# Altium schematic sheet FMC_HPC2.SchDoc: AMC FMC Carrier v4
size A2; CompanyName: WUT; Organization: WUT ISE; Address1: Warsaw Univeristy of Technology; Address2: Nowowiejska 15/19 00-665 Warsaw; Address3: t.przywozki@gmail.com; Revision: 1; SheetNumber: 8; SheetTotal: 29; Project: AMC FMC Carrier v4; ModifiedBy: -; CheckedDate: -; Title2: FPGA banks HPC2 / RTM; DivGrp: ISE; Designer: T. Przywozki; ModifiedDate: -; ProjectName: ADC/DAC MEZZANINE
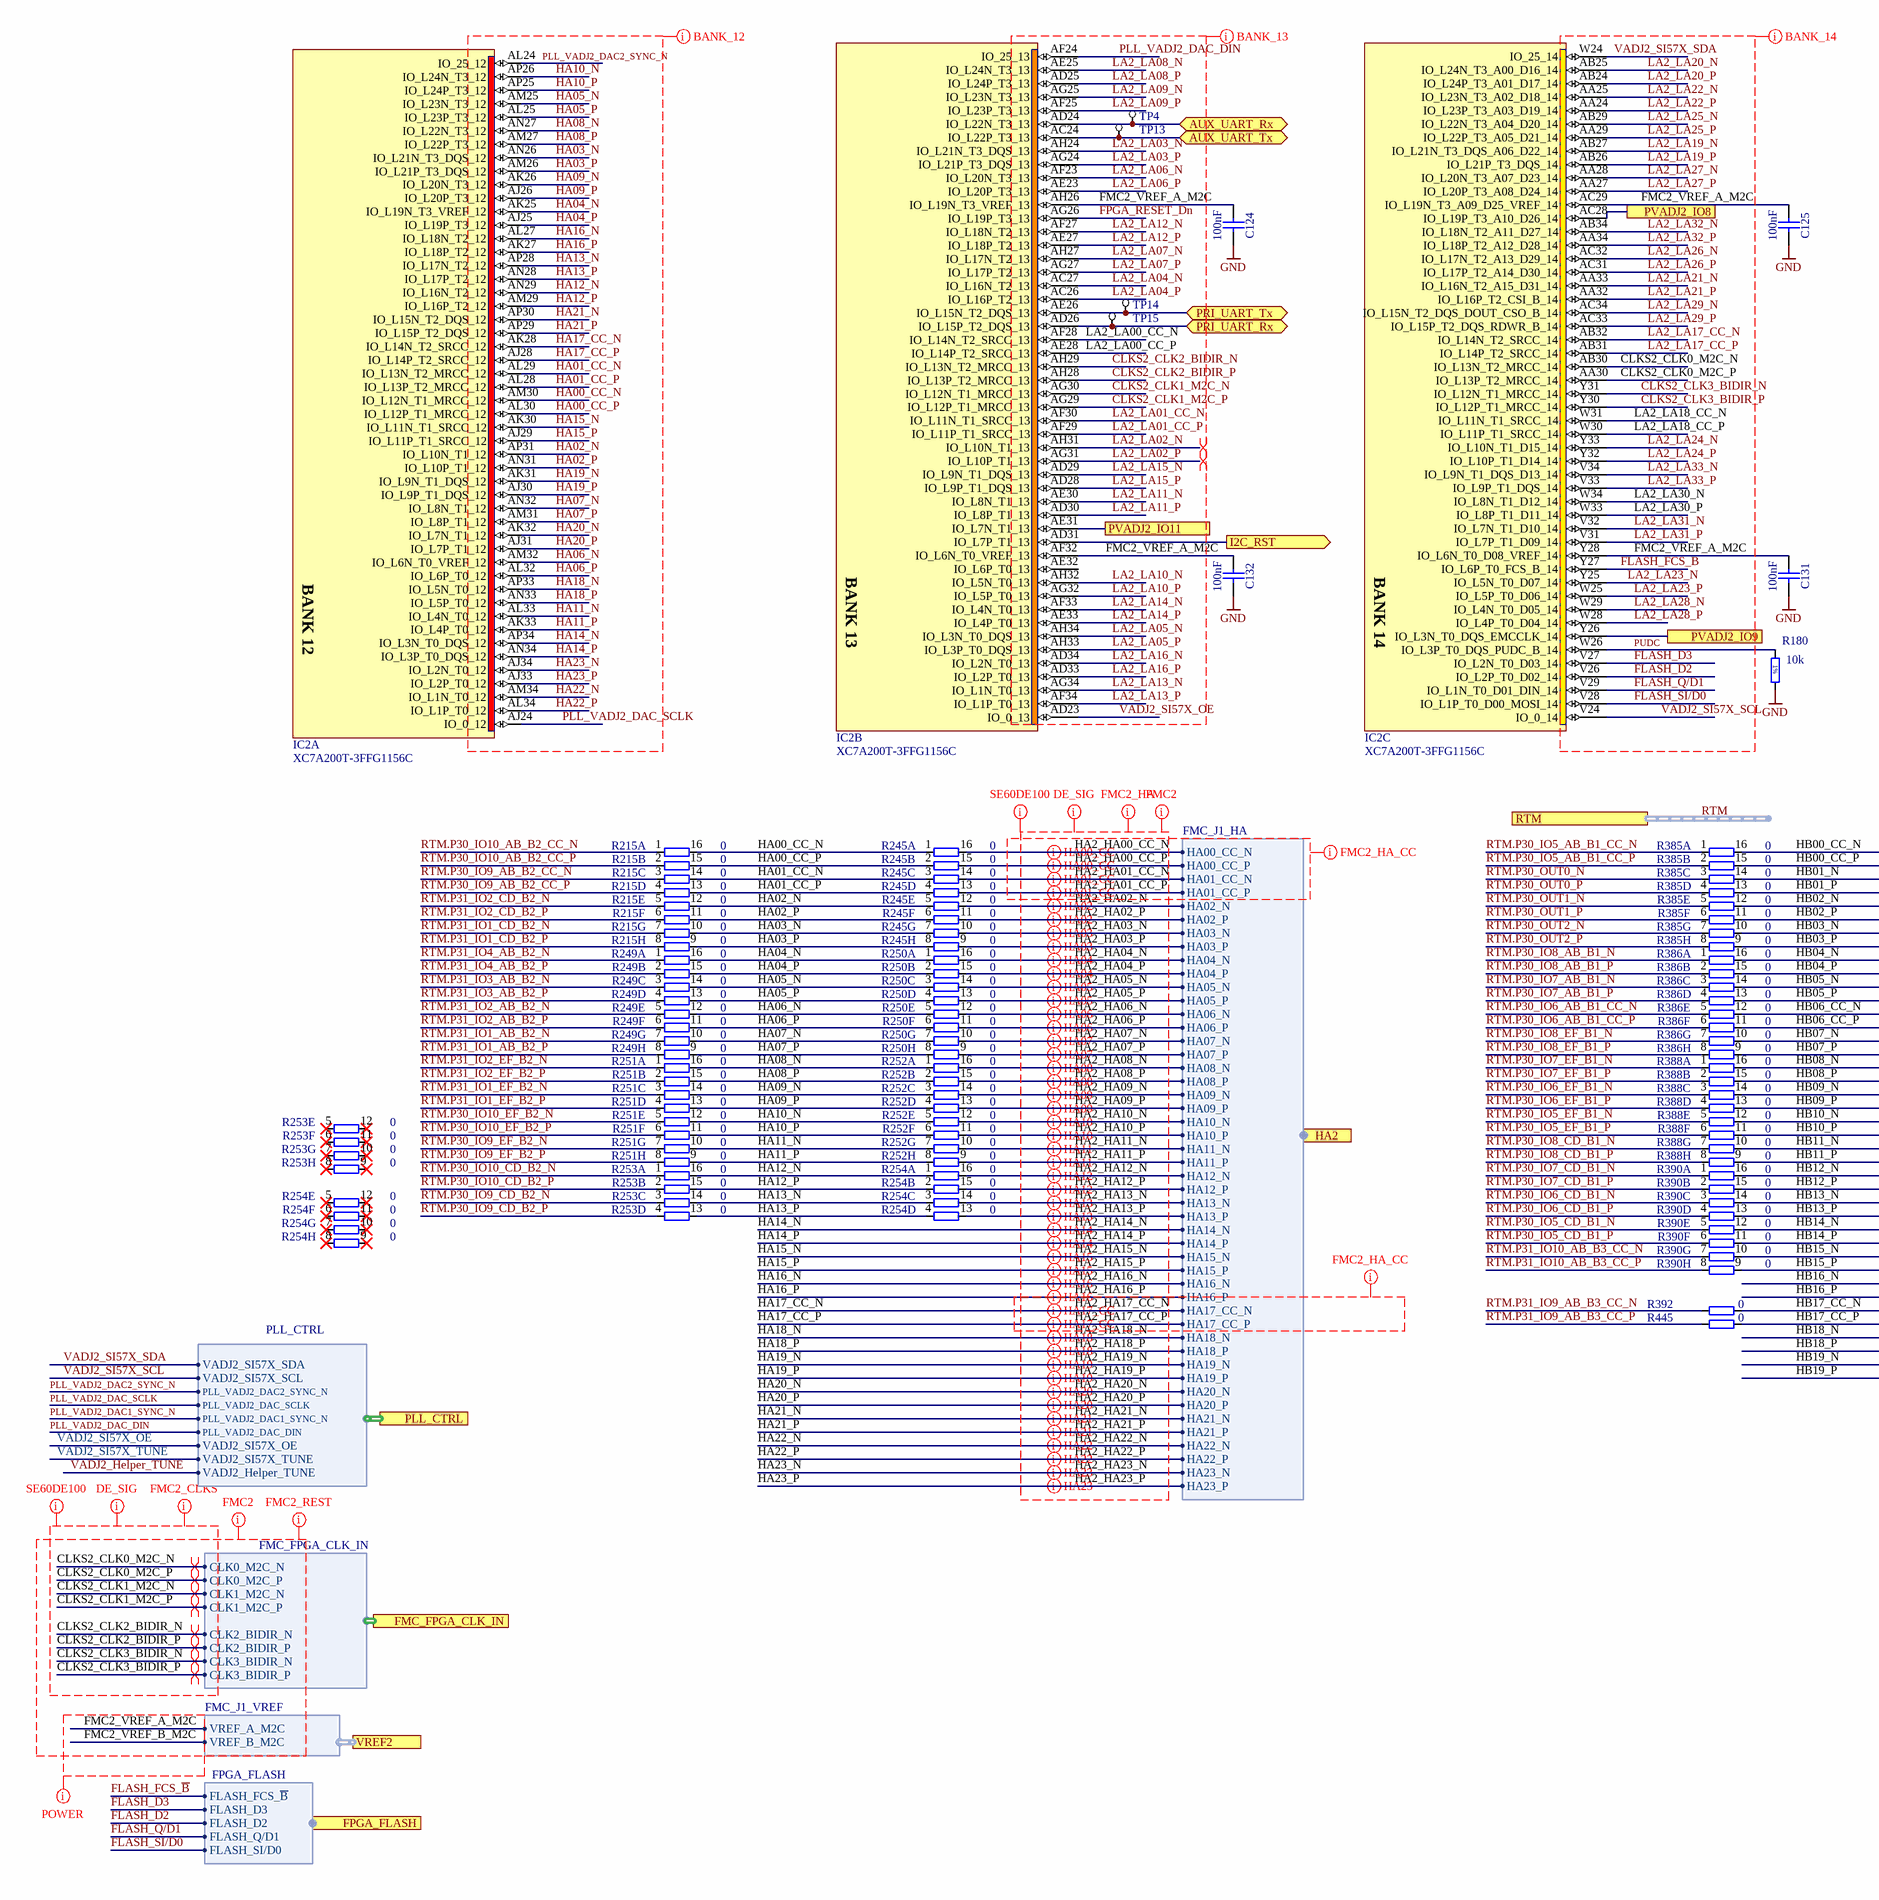
[diagram p0: FMC_HPC2.SchDoc, left]
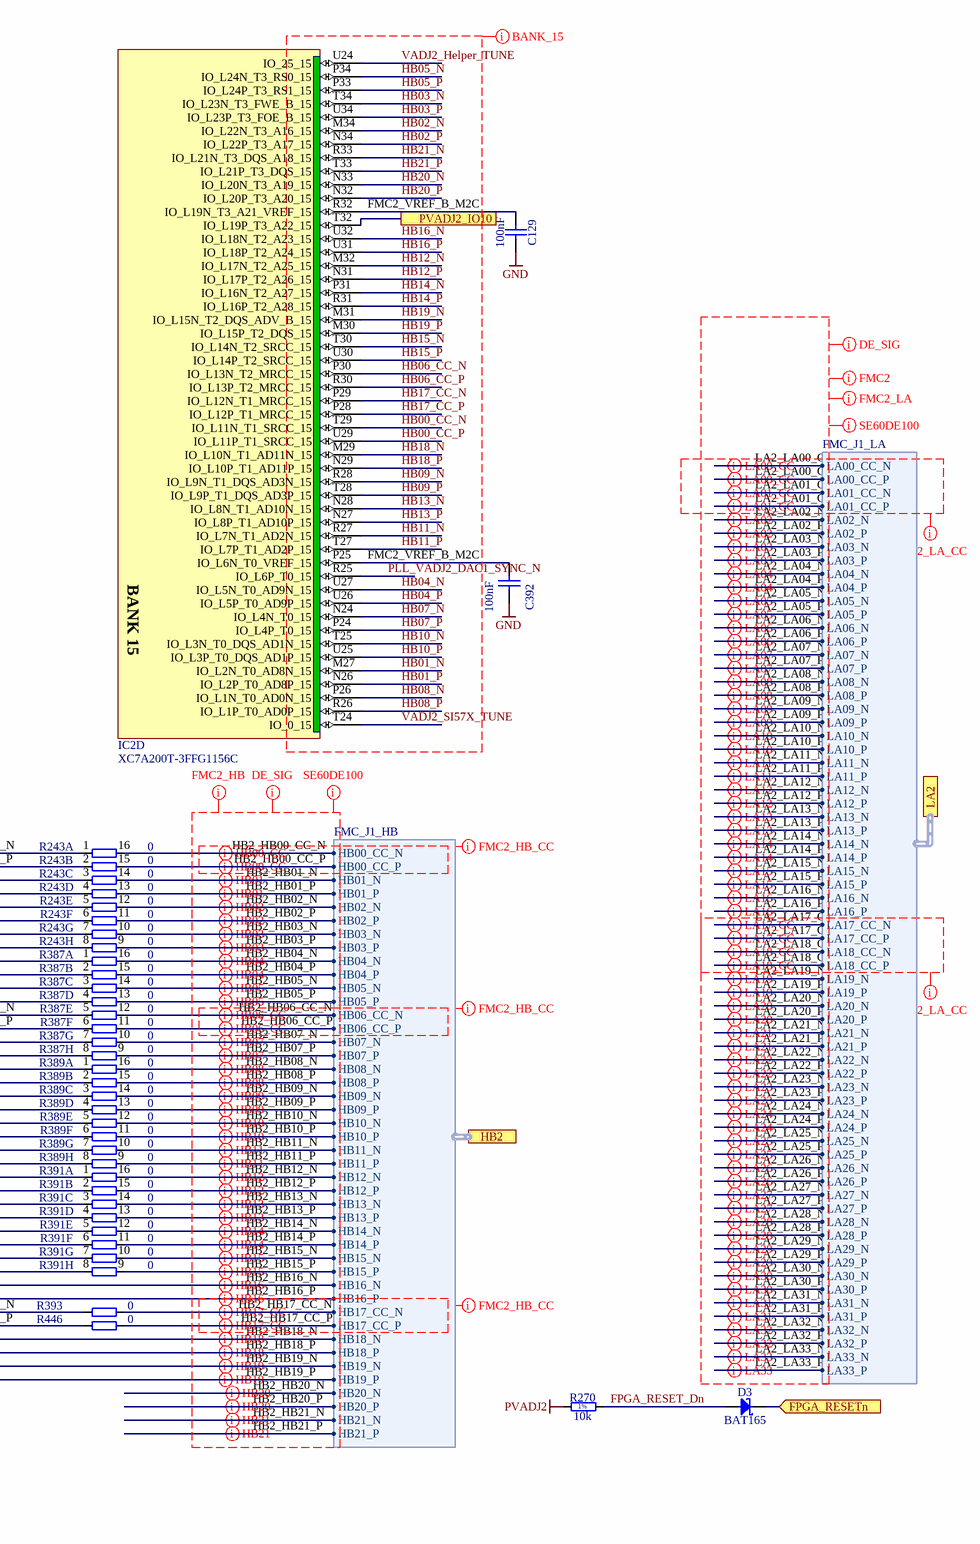
[diagram p1: FMC_HPC2.SchDoc, right]

## Parts
C124  100nF  [CAPC0603X33N]
C125  100nF  [CAPC0603X33N]
C129  100nF  [CAPC0603X33N]
C131  100nF  [CAPC0603X33N]
C132  100nF  [CAPC0603X33N]
C392  100nF  [CAPC0603X33N]
D3  BAT165  [SOD2512X110N]
IC2  XC7A200T-3FFG1156C  [BGA1156C100P34X34_3500X3500X335]  (parts A,B,C,D of 23)
R180  10k  [RESC1005X40N]
R215  0  [EXB2HV_PAN]  (parts A,B,C,D,E,F,G,H of 8)
R243  0  [EXB2HV_PAN]  (parts A,B,C,D,E,F,G,H of 8)
R245  0  [EXB2HV_PAN]  (parts A,B,C,D,E,F,G,H of 8)
R249  0  [EXB2HV_PAN]  (parts A,B,C,D,E,F,G,H of 8)
R250  0  [EXB2HV_PAN]  (parts A,B,C,D,E,F,G,H of 8)
R251  0  [EXB2HV_PAN]  (parts A,B,C,D,E,F,G,H of 8)
R252  0  [EXB2HV_PAN]  (parts A,B,C,D,E,F,G,H of 8)
R253  0  [EXB2HV_PAN]  (parts A,B,C,D,E,F,G,H of 8)
R254  0  [EXB2HV_PAN]  (parts A,B,C,D,E,F,G,H of 8)
R270  10k  [RESC1005X40N]
R385  0  [EXB2HV_PAN]  (parts A,B,C,D,E,F,G,H of 8)
R386  0  [EXB2HV_PAN]  (parts A,B,C,D,E,F,G,H of 8)
R387  0  [EXB2HV_PAN]  (parts A,B,C,D,E,F,G,H of 8)
R388  0  [EXB2HV_PAN]  (parts A,B,C,D,E,F,G,H of 8)
R389  0  [EXB2HV_PAN]  (parts A,B,C,D,E,F,G,H of 8)
R390  0  [EXB2HV_PAN]  (parts A,B,C,D,E,F,G,H of 8)
R391  0  [EXB2HV_PAN]  (parts A,B,C,D,E,F,G,H of 8)
R392  0  [RESC0603X28N]
R393  0  [RESC0603X28N]
R445  0  [RESC0603X28N]
R446  0  [RESC0603X28N]
TP4  TP  [TP_large]  (value not drawn)
TP13  TP  [TP_large]  (value not drawn)
TP14  TP  [TP_large]  (value not drawn)
TP15  TP  [TP_large]  (value not drawn)

## Ports
AUX_UART_Rx (bidir), AUX_UART_Tx (bidir), FMC_FPGA_CLK_IN (harness FMC_FPGA_CLK_IN), FPGA_FLASH (harness FPGA_FLASH), FPGA_RESETn (in), HA2 (harness FMC_J1_HA), HB2 (harness FMC_J1_HB), I2C_RST (out), LA2 (harness FMC_J1_LA), PLL_CTRL (harness PLL_CTRL), PRI_UART_Rx (bidir), PRI_UART_Tx (bidir), PVADJ2_IO8, PVADJ2_IO9, PVADJ2_IO10, PVADJ2_IO11, RTM (harness RTM), VREF2 (harness FMC_J1_VREF)

## Harnesses
FMC_J1_LA: LA05_N, LA05_P, LA06_N, LA06_P, LA09_N, LA09_P, LA10_N, LA10_P, LA13_N, LA13_P, LA14_N, LA14_P, LA23_N, LA23_P, LA26_N, LA26_P, LA27_N, LA27_P, LA02_N, LA02_P, LA03_N, LA03_P, LA04_N, LA04_P, LA07_N, LA07_P, LA08_N, LA08_P, LA11_N, LA11_P, LA12_N, LA12_P, LA15_N, LA15_P, LA16_N, LA16_P, LA19_N, LA19_P, LA20_N, LA20_P, LA21_N, LA21_P, LA22_N, LA22_P, LA24_N, LA24_P, LA25_N, LA25_P, LA28_N, LA28_P, LA29_N, LA29_P, LA30_N, LA30_P, LA31_N, LA31_P, LA32_N, LA32_P, LA33_N, LA33_P, LA00_CC_N, LA00_CC_P, LA01_CC_N, LA01_CC_P, LA17_CC_N, LA17_CC_P, LA18_CC_N, LA18_CC_P
FMC_J1_HA: HA04_N, HA04_P, HA05_N, HA05_P, HA08_N, HA08_P, HA09_N, HA09_P, HA12_N, HA12_P, HA13_N, HA13_P, HA15_N, HA15_P, HA16_N, HA16_P, HA19_N, HA19_P, HA20_N, HA20_P, HA02_N, HA02_P, HA03_N, HA03_P, HA06_N, HA06_P, HA07_N, HA07_P, HA10_N, HA10_P, HA11_N, HA11_P, HA14_N, HA14_P, HA18_N, HA18_P, HA21_N, HA21_P, HA22_N, HA22_P, HA23_N, HA23_P, HA17_CC_N, HA17_CC_P, HA00_CC_N, HA00_CC_P, HA01_CC_N, HA01_CC_P
FMC_J1_HB: HB02_N, HB02_P, HB03_N, HB03_P, HB04_N, HB04_P, HB05_N, HB05_P, HB08_N, HB08_P, HB09_N, HB09_P, HB12_N, HB12_P, HB13_N, HB13_P, HB16_N, HB16_P, HB19_N, HB19_P, HB20_N, HB20_P, HB21_N, HB21_P, HB01_N, HB01_P, HB07_N, HB07_P, HB10_N, HB10_P, HB11_N, HB11_P, HB14_N, HB14_P, HB15_N, HB15_P, HB18_N, HB18_P, HB17_CC_N, HB17_CC_P, HB06_CC_N, HB06_CC_P, HB00_CC_N, HB00_CC_P
FMC_FPGA_CLK_IN: CLK0_M2C_N, CLK0_M2C_P, CLK1_M2C_N, CLK1_M2C_P, CLK2_BIDIR_N, CLK2_BIDIR_P, CLK3_BIDIR_N, CLK3_BIDIR_P
FPGA_FLASH: FLASH_FCS_~{B}, FLASH_D3, FLASH_D2, FLASH_Q/D1, FLASH_SI/D0
PLL_CTRL: PLL_VADJ2_DAC2_SYNC_N, PLL_VADJ2_DAC_SCLK, PLL_VADJ2_DAC1_SYNC_N, PLL_VADJ2_DAC_DIN, VADJ2_SI57X_OE, VADJ2_SI57X_TUNE, VADJ2_SI57X_SDA, VADJ2_SI57X_SCL, VADJ2_Helper_TUNE
FMC_J1_VREF: VREF_A_M2C, VREF_B_M2C

## Nets
GND: C124.2 C125.2 C129.2 C131.2 C132.2 C392.2 R180.2
PVADJ2: R270.1
AUX_UART_Rx: IC2.AD24(IO_L22N_T3_13) TP4.1 ; port AUX_UART_Rx
AUX_UART_Tx: IC2.AC24(IO_L22P_T3_13) TP13.1 ; port AUX_UART_Tx
CLKS2_CLK0_M2C_N: IC2.AB30(IO_L13N_T2_MRCC_14) ; port FMC_FPGA_CLK_IN.CLK0_M2C_N
CLKS2_CLK0_M2C_P: IC2.AA30(IO_L13P_T2_MRCC_14) ; port FMC_FPGA_CLK_IN.CLK0_M2C_P
CLKS2_CLK1_M2C_N: IC2.AG30(IO_L12N_T1_MRCC_13) ; port FMC_FPGA_CLK_IN.CLK1_M2C_N
CLKS2_CLK1_M2C_P: IC2.AG29(IO_L12P_T1_MRCC_13) ; port FMC_FPGA_CLK_IN.CLK1_M2C_P
CLKS2_CLK2_BIDIR_N: IC2.AH29(IO_L13N_T2_MRCC_13) ; port FMC_FPGA_CLK_IN.CLK2_BIDIR_N
CLKS2_CLK2_BIDIR_P: IC2.AH28(IO_L13P_T2_MRCC_13) ; port FMC_FPGA_CLK_IN.CLK2_BIDIR_P
CLKS2_CLK3_BIDIR_N: IC2.Y31(IO_L12N_T1_MRCC_14) ; port FMC_FPGA_CLK_IN.CLK3_BIDIR_N
CLKS2_CLK3_BIDIR_P: IC2.Y30(IO_L12P_T1_MRCC_14) ; port FMC_FPGA_CLK_IN.CLK3_BIDIR_P
FLASH_D2: IC2.V26(IO_L2P_T0_D02_14) ; port FPGA_FLASH.FLASH_D2
FLASH_D3: IC2.V27(IO_L2N_T0_D03_14) ; port FPGA_FLASH.FLASH_D3
FLASH_FCS_~{B}: IC2.Y27(IO_L6P_T0_FCS_B_14) ; port FPGA_FLASH.FLASH_FCS_~{B}
FLASH_Q/D1: IC2.V29(IO_L1N_T0_D01_DIN_14) ; port FPGA_FLASH.FLASH_Q/D1
FLASH_SI/D0: IC2.V28(IO_L1P_T0_D00_MOSI_14) ; port FPGA_FLASH.FLASH_SI/D0
FMC2_VREF_A_M2C: C124.1 C125.1 C131.1 C132.1 IC2.AC29(IO_L19N_T3_A09_D25_VREF_14) IC2.AF32(IO_L6N_T0_VREF_13) IC2.AH26(IO_L19N_T3_VREF_13) IC2.Y28(IO_L6N_T0_D08_VREF_14) ; port VREF2.VREF_A_M2C
FMC2_VREF_B_M2C: C129.1 C392.1 IC2.P25(IO_L6N_T0_VREF_15) IC2.R32(IO_L19N_T3_A21_VREF_15) ; port VREF2.VREF_B_M2C
FPGA_RESET_Dn: D3.2(A) IC2.AG26(IO_L19P_T3_13) R270.2
FPGA_RESETn: D3.1(C) ; port FPGA_RESETn
HA00_CC_N: IC2.AM30(IO_L12N_T1_MRCC_12) R215.16 R245.1
HA00_CC_P: IC2.AL30(IO_L12P_T1_MRCC_12) R215.15 R245.2
HA01_CC_N: IC2.AL29(IO_L13N_T2_MRCC_12) R215.14 R245.3
HA01_CC_P: IC2.AL28(IO_L13P_T2_MRCC_12) R215.13 R245.4
HA2_HA00_CC_N: R245.16 ; port HA2.HA00_CC_N
HA2_HA00_CC_P: R245.15 ; port HA2.HA00_CC_P
HA2_HA01_CC_N: R245.14 ; port HA2.HA01_CC_N
HA2_HA01_CC_P: R245.13 ; port HA2.HA01_CC_P
HA2_HA02_N: R245.12 ; port HA2.HA02_N
HA2_HA02_P: R245.11 ; port HA2.HA02_P
HA2_HA03_N: R245.10 ; port HA2.HA03_N
HA2_HA03_P: R245.9 ; port HA2.HA03_P
HA2_HA04_N: R250.16 ; port HA2.HA04_N
HA2_HA04_P: R250.15 ; port HA2.HA04_P
HA2_HA05_N: R250.14 ; port HA2.HA05_N
HA2_HA05_P: R250.13 ; port HA2.HA05_P
HA2_HA06_N: R250.12 ; port HA2.HA06_N
HA2_HA06_P: R250.11 ; port HA2.HA06_P
HA2_HA07_N: R250.10 ; port HA2.HA07_N
HA2_HA07_P: R250.9 ; port HA2.HA07_P
HA2_HA08_N: R252.16 ; port HA2.HA08_N
HA2_HA08_P: R252.15 ; port HA2.HA08_P
HA2_HA09_N: R252.14 ; port HA2.HA09_N
HA2_HA09_P: R252.13 ; port HA2.HA09_P
HA2_HA10_N: R252.12 ; port HA2.HA10_N
HA2_HA10_P: R252.11 ; port HA2.HA10_P
HA2_HA11_N: R252.10 ; port HA2.HA11_N
HA2_HA11_P: R252.9 ; port HA2.HA11_P
HA2_HA12_N: R254.16 ; port HA2.HA12_N
HA2_HA12_P: R254.15 ; port HA2.HA12_P
HA2_HA13_N: R254.14 ; port HA2.HA13_N
HA2_HA13_P: R254.13 ; port HA2.HA13_P
HA02_N: IC2.AP31(IO_L10N_T1_12) R215.12 R245.5
HA02_P: IC2.AN31(IO_L10P_T1_12) R215.11 R245.6
HA03_N: IC2.AN26(IO_L21N_T3_DQS_12) R215.10 R245.7
HA03_P: IC2.AM26(IO_L21P_T3_DQS_12) R215.9 R245.8
HA04_N: IC2.AK25(IO_L19N_T3_VREF_12) R249.16 R250.1
HA04_P: IC2.AJ25(IO_L19P_T3_12) R249.15 R250.2
HA05_N: IC2.AM25(IO_L23N_T3_12) R249.14 R250.3
HA05_P: IC2.AL25(IO_L23P_T3_12) R249.13 R250.4
HA06_N: IC2.AM32(IO_L6N_T0_VREF_12) R249.12 R250.5
HA06_P: IC2.AL32(IO_L6P_T0_12) R249.11 R250.6
HA07_N: IC2.AN32(IO_L8N_T1_12) R249.10 R250.7
HA07_P: IC2.AM31(IO_L8P_T1_12) R249.9 R250.8
HA08_N: IC2.AN27(IO_L22N_T3_12) R251.16 R252.1
HA08_P: IC2.AM27(IO_L22P_T3_12) R251.15 R252.2
HA09_N: IC2.AK26(IO_L20N_T3_12) R251.14 R252.3
HA09_P: IC2.AJ26(IO_L20P_T3_12) R251.13 R252.4
HA10_N: IC2.AP26(IO_L24N_T3_12) R251.12 R252.5
HA10_P: IC2.AP25(IO_L24P_T3_12) R251.11 R252.6
HA11_N: IC2.AL33(IO_L4N_T0_12) R251.10 R252.7
HA11_P: IC2.AK33(IO_L4P_T0_12) R251.9 R252.8
HA12_N: IC2.AN29(IO_L16N_T2_12) R253.16 R254.1
HA12_P: IC2.AM29(IO_L16P_T2_12) R253.15 R254.2
HA13_N: IC2.AP28(IO_L17N_T2_12) R253.14 R254.3
HA13_P: IC2.AN28(IO_L17P_T2_12) R253.13 R254.4
HA14_N: IC2.AP34(IO_L3N_T0_DQS_12) ; port HA2.HA14_N  [also labelled HA2_HA14_N]
HA14_P: IC2.AN34(IO_L3P_T0_DQS_12) ; port HA2.HA14_P  [also labelled HA2_HA14_P]
HA15_N: IC2.AK30(IO_L11N_T1_SRCC_12) ; port HA2.HA15_N  [also labelled HA2_HA15_N]
HA15_P: IC2.AJ29(IO_L11P_T1_SRCC_12) ; port HA2.HA15_P  [also labelled HA2_HA15_P]
HA16_N: IC2.AL27(IO_L18N_T2_12) ; port HA2.HA16_N  [also labelled HA2_HA16_N]
HA16_P: IC2.AK27(IO_L18P_T2_12) ; port HA2.HA16_P  [also labelled HA2_HA16_P]
HA17_CC_N: IC2.AK28(IO_L14N_T2_SRCC_12) ; port HA2.HA17_CC_N  [also labelled HA2_HA17_CC_N]
HA17_CC_P: IC2.AJ28(IO_L14P_T2_SRCC_12) ; port HA2.HA17_CC_P  [also labelled HA2_HA17_CC_P]
HA18_N: IC2.AP33(IO_L5N_T0_12) ; port HA2.HA18_N  [also labelled HA2_HA18_N]
HA18_P: IC2.AN33(IO_L5P_T0_12) ; port HA2.HA18_P  [also labelled HA2_HA18_P]
HA19_N: IC2.AK31(IO_L9N_T1_DQS_12) ; port HA2.HA19_N  [also labelled HA2_HA19_N]
HA19_P: IC2.AJ30(IO_L9P_T1_DQS_12) ; port HA2.HA19_P  [also labelled HA2_HA19_P]
HA20_N: IC2.AK32(IO_L7N_T1_12) ; port HA2.HA20_N  [also labelled HA2_HA20_N]
HA20_P: IC2.AJ31(IO_L7P_T1_12) ; port HA2.HA20_P  [also labelled HA2_HA20_P]
HA21_N: IC2.AP30(IO_L15N_T2_DQS_12) ; port HA2.HA21_N  [also labelled HA2_HA21_N]
HA21_P: IC2.AP29(IO_L15P_T2_DQS_12) ; port HA2.HA21_P  [also labelled HA2_HA21_P]
HA22_N: IC2.AM34(IO_L1N_T0_12) ; port HA2.HA22_N  [also labelled HA2_HA22_N]
HA22_P: IC2.AL34(IO_L1P_T0_12) ; port HA2.HA22_P  [also labelled HA2_HA22_P]
HA23_N: IC2.AJ34(IO_L2N_T0_12) ; port HA2.HA23_N  [also labelled HA2_HA23_N]
HA23_P: IC2.AJ33(IO_L2P_T0_12) ; port HA2.HA23_P  [also labelled HA2_HA23_P]
HB00_CC_N: IC2.T29(IO_L11N_T1_SRCC_15) R243.1 R385.16
HB00_CC_P: IC2.U29(IO_L11P_T1_SRCC_15) R243.2 R385.15
HB01_N: IC2.M27(IO_L2N_T0_AD8N_15) R243.3 R385.14
HB01_P: IC2.N26(IO_L2P_T0_AD8P_15) R243.4 R385.13
HB2_HB00_CC_N: R243.16 ; port HB2.HB00_CC_N
HB2_HB00_CC_P: R243.15 ; port HB2.HB00_CC_P
HB2_HB01_N: R243.14 ; port HB2.HB01_N
HB2_HB01_P: R243.13 ; port HB2.HB01_P
HB2_HB02_N: R243.12 ; port HB2.HB02_N
HB2_HB02_P: R243.11 ; port HB2.HB02_P
HB2_HB03_N: R243.10 ; port HB2.HB03_N
HB2_HB03_P: R243.9 ; port HB2.HB03_P
HB2_HB04_N: R387.16 ; port HB2.HB04_N
HB2_HB04_P: R387.15 ; port HB2.HB04_P
HB2_HB05_N: R387.14 ; port HB2.HB05_N
HB2_HB05_P: R387.13 ; port HB2.HB05_P
HB2_HB06_CC_N: R387.12 ; port HB2.HB06_CC_N
HB2_HB06_CC_P: R387.11 ; port HB2.HB06_CC_P
HB2_HB07_N: R387.10 ; port HB2.HB07_N
HB2_HB07_P: R387.9 ; port HB2.HB07_P
HB2_HB08_N: R389.16 ; port HB2.HB08_N
HB2_HB08_P: R389.15 ; port HB2.HB08_P
HB2_HB09_N: R389.14 ; port HB2.HB09_N
HB2_HB09_P: R389.13 ; port HB2.HB09_P
HB2_HB10_N: R389.12 ; port HB2.HB10_N
HB2_HB10_P: R389.11 ; port HB2.HB10_P
HB2_HB11_N: R389.10 ; port HB2.HB11_N
HB2_HB11_P: R389.9 ; port HB2.HB11_P
HB2_HB12_N: R391.16 ; port HB2.HB12_N
HB2_HB12_P: R391.15 ; port HB2.HB12_P
HB2_HB13_N: R391.14 ; port HB2.HB13_N
HB2_HB13_P: R391.13 ; port HB2.HB13_P
HB2_HB14_N: R391.12 ; port HB2.HB14_N
HB2_HB14_P: R391.11 ; port HB2.HB14_P
HB2_HB15_N: R391.10 ; port HB2.HB15_N
HB2_HB15_P: R391.9 ; port HB2.HB15_P
HB2_HB17_CC_N: R393.2 ; port HB2.HB17_CC_N
HB2_HB17_CC_P: R446.2 ; port HB2.HB17_CC_P
HB2_HB20_N: port HB2.HB20_N
HB2_HB20_P: port HB2.HB20_P
HB2_HB21_N: port HB2.HB21_N
HB2_HB21_P: port HB2.HB21_P
HB02_N: IC2.M34(IO_L22N_T3_A16_15) R243.5 R385.12
HB02_P: IC2.N34(IO_L22P_T3_A17_15) R243.6 R385.11
HB03_N: IC2.T34(IO_L23N_T3_FWE_B_15) R243.7 R385.10
HB03_P: IC2.U34(IO_L23P_T3_FOE_B_15) R243.8 R385.9
HB04_N: IC2.U27(IO_L5N_T0_AD9N_15) R386.16 R387.1
HB04_P: IC2.U26(IO_L5P_T0_AD9P_15) R386.15 R387.2
HB05_N: IC2.P34(IO_L24N_T3_RS0_15) R386.14 R387.3
HB05_P: IC2.P33(IO_L24P_T3_RS1_15) R386.13 R387.4
HB06_CC_N: IC2.P30(IO_L13N_T2_MRCC_15) R386.12 R387.5
HB06_CC_P: IC2.R30(IO_L13P_T2_MRCC_15) R386.11 R387.6
HB07_N: IC2.N24(IO_L4N_T0_15) R386.10 R387.7
HB07_P: IC2.P24(IO_L4P_T0_15) R386.9 R387.8
HB08_N: IC2.P26(IO_L1N_T0_AD0N_15) R388.16 R389.1
HB08_P: IC2.R26(IO_L1P_T0_AD0P_15) R388.15 R389.2
HB09_N: IC2.R28(IO_L9N_T1_DQS_AD3N_15) R388.14 R389.3
HB09_P: IC2.T28(IO_L9P_T1_DQS_AD3P_15) R388.13 R389.4
HB10_N: IC2.T25(IO_L3N_T0_DQS_AD1N_15) R388.12 R389.5
HB10_P: IC2.U25(IO_L3P_T0_DQS_AD1P_15) R388.11 R389.6
HB11_N: IC2.R27(IO_L7N_T1_AD2N_15) R388.10 R389.7
HB11_P: IC2.T27(IO_L7P_T1_AD2P_15) R388.9 R389.8
HB12_N: IC2.M32(IO_L17N_T2_A25_15) R390.16 R391.1
HB12_P: IC2.N31(IO_L17P_T2_A26_15) R390.15 R391.2
HB13_N: IC2.N28(IO_L8N_T1_AD10N_15) R390.14 R391.3
HB13_P: IC2.N27(IO_L8P_T1_AD10P_15) R390.13 R391.4
HB14_N: IC2.P31(IO_L16N_T2_A27_15) R390.12 R391.5
HB14_P: IC2.R31(IO_L16P_T2_A28_15) R390.11 R391.6
HB15_N: IC2.T30(IO_L14N_T2_SRCC_15) R390.10 R391.7
HB15_P: IC2.U30(IO_L14P_T2_SRCC_15) R390.9 R391.8
HB16_N: IC2.U32(IO_L18N_T2_A23_15) ; port HB2.HB16_N  [also labelled HB2_HB16_N]
HB16_P: IC2.U31(IO_L18P_T2_A24_15) ; port HB2.HB16_P  [also labelled HB2_HB16_P]
HB17_CC_N: IC2.P29(IO_L12N_T1_MRCC_15) R392.2 R393.1
HB17_CC_P: IC2.P28(IO_L12P_T1_MRCC_15) R445.2 R446.1
HB18_N: IC2.M29(IO_L10N_T1_AD11N_15) ; port HB2.HB18_N  [also labelled HB2_HB18_N]
HB18_P: IC2.N29(IO_L10P_T1_AD11P_15) ; port HB2.HB18_P  [also labelled HB2_HB18_P]
HB19_N: IC2.M31(IO_L15N_T2_DQS_ADV_B_15) ; port HB2.HB19_N  [also labelled HB2_HB19_N]
HB19_P: IC2.M30(IO_L15P_T2_DQS_15) ; port HB2.HB19_P  [also labelled HB2_HB19_P]
HB20_N: IC2.N33(IO_L20N_T3_A19_15)
HB20_P: IC2.N32(IO_L20P_T3_A20_15)
HB21_N: IC2.R33(IO_L21N_T3_DQS_A18_15)
HB21_P: IC2.T33(IO_L21P_T3_DQS_15)
I2C_RST: IC2.AD31(IO_L7P_T1_13) ; port I2C_RST
LA2_LA00_CC_N: IC2.AF28(IO_L14N_T2_SRCC_13) ; port LA2.LA00_CC_N
LA2_LA00_CC_P: IC2.AE28(IO_L14P_T2_SRCC_13) ; port LA2.LA00_CC_P
LA2_LA01_CC_N: IC2.AF30(IO_L11N_T1_SRCC_13) ; port LA2.LA01_CC_N
LA2_LA01_CC_P: IC2.AF29(IO_L11P_T1_SRCC_13) ; port LA2.LA01_CC_P
LA2_LA02_N: IC2.AH31(IO_L10N_T1_13) ; port LA2.LA02_N
LA2_LA02_P: IC2.AG31(IO_L10P_T1_13) ; port LA2.LA02_P
LA2_LA03_N: IC2.AH24(IO_L21N_T3_DQS_13) ; port LA2.LA03_N
LA2_LA03_P: IC2.AG24(IO_L21P_T3_DQS_13) ; port LA2.LA03_P
LA2_LA04_N: IC2.AC27(IO_L16N_T2_13) ; port LA2.LA04_N
LA2_LA04_P: IC2.AC26(IO_L16P_T2_13) ; port LA2.LA04_P
LA2_LA05_N: IC2.AH34(IO_L3N_T0_DQS_13) ; port LA2.LA05_N
LA2_LA05_P: IC2.AH33(IO_L3P_T0_DQS_13) ; port LA2.LA05_P
LA2_LA06_N: IC2.AF23(IO_L20N_T3_13) ; port LA2.LA06_N
LA2_LA06_P: IC2.AE23(IO_L20P_T3_13) ; port LA2.LA06_P
LA2_LA07_N: IC2.AH27(IO_L17N_T2_13) ; port LA2.LA07_N
LA2_LA07_P: IC2.AG27(IO_L17P_T2_13) ; port LA2.LA07_P
LA2_LA08_N: IC2.AE25(IO_L24N_T3_13) ; port LA2.LA08_N
LA2_LA08_P: IC2.AD25(IO_L24P_T3_13) ; port LA2.LA08_P
LA2_LA09_N: IC2.AG25(IO_L23N_T3_13) ; port LA2.LA09_N
LA2_LA09_P: IC2.AF25(IO_L23P_T3_13) ; port LA2.LA09_P
LA2_LA10_N: IC2.AH32(IO_L5N_T0_13) ; port LA2.LA10_N
LA2_LA10_P: IC2.AG32(IO_L5P_T0_13) ; port LA2.LA10_P
LA2_LA11_N: IC2.AE30(IO_L8N_T1_13) ; port LA2.LA11_N
LA2_LA11_P: IC2.AD30(IO_L8P_T1_13) ; port LA2.LA11_P
LA2_LA12_N: IC2.AF27(IO_L18N_T2_13) ; port LA2.LA12_N
LA2_LA12_P: IC2.AE27(IO_L18P_T2_13) ; port LA2.LA12_P
LA2_LA13_N: IC2.AG34(IO_L1N_T0_13) ; port LA2.LA13_N
LA2_LA13_P: IC2.AF34(IO_L1P_T0_13) ; port LA2.LA13_P
LA2_LA14_N: IC2.AF33(IO_L4N_T0_13) ; port LA2.LA14_N
LA2_LA14_P: IC2.AE33(IO_L4P_T0_13) ; port LA2.LA14_P
LA2_LA15_N: IC2.AD29(IO_L9N_T1_DQS_13) ; port LA2.LA15_N
LA2_LA15_P: IC2.AD28(IO_L9P_T1_DQS_13) ; port LA2.LA15_P
LA2_LA16_N: IC2.AD34(IO_L2N_T0_13) ; port LA2.LA16_N
LA2_LA16_P: IC2.AD33(IO_L2P_T0_13) ; port LA2.LA16_P
LA2_LA17_CC_N: IC2.AB32(IO_L14N_T2_SRCC_14) ; port LA2.LA17_CC_N
LA2_LA17_CC_P: IC2.AB31(IO_L14P_T2_SRCC_14) ; port LA2.LA17_CC_P
LA2_LA18_CC_N: IC2.W31(IO_L11N_T1_SRCC_14) ; port LA2.LA18_CC_N
LA2_LA18_CC_P: IC2.W30(IO_L11P_T1_SRCC_14) ; port LA2.LA18_CC_P
LA2_LA19_N: IC2.AB27(IO_L21N_T3_DQS_A06_D22_14) ; port LA2.LA19_N
LA2_LA19_P: IC2.AB26(IO_L21P_T3_DQS_14) ; port LA2.LA19_P
LA2_LA20_N: IC2.AB25(IO_L24N_T3_A00_D16_14) ; port LA2.LA20_N
LA2_LA20_P: IC2.AB24(IO_L24P_T3_A01_D17_14) ; port LA2.LA20_P
LA2_LA21_N: IC2.AA33(IO_L16N_T2_A15_D31_14) ; port LA2.LA21_N
LA2_LA21_P: IC2.AA32(IO_L16P_T2_CSI_B_14) ; port LA2.LA21_P
LA2_LA22_N: IC2.AA25(IO_L23N_T3_A02_D18_14) ; port LA2.LA22_N
LA2_LA22_P: IC2.AA24(IO_L23P_T3_A03_D19_14) ; port LA2.LA22_P
LA2_LA23_N: IC2.Y25(IO_L5N_T0_D07_14) ; port LA2.LA23_N
LA2_LA23_P: IC2.W25(IO_L5P_T0_D06_14) ; port LA2.LA23_P
LA2_LA24_N: IC2.Y33(IO_L10N_T1_D15_14) ; port LA2.LA24_N
LA2_LA24_P: IC2.Y32(IO_L10P_T1_D14_14) ; port LA2.LA24_P
LA2_LA25_N: IC2.AB29(IO_L22N_T3_A04_D20_14) ; port LA2.LA25_N
LA2_LA25_P: IC2.AA29(IO_L22P_T3_A05_D21_14) ; port LA2.LA25_P
LA2_LA26_N: IC2.AC32(IO_L17N_T2_A13_D29_14) ; port LA2.LA26_N
LA2_LA26_P: IC2.AC31(IO_L17P_T2_A14_D30_14) ; port LA2.LA26_P
LA2_LA27_N: IC2.AA28(IO_L20N_T3_A07_D23_14) ; port LA2.LA27_N
LA2_LA27_P: IC2.AA27(IO_L20P_T3_A08_D24_14) ; port LA2.LA27_P
LA2_LA28_N: IC2.W29(IO_L4N_T0_D05_14) ; port LA2.LA28_N
LA2_LA28_P: IC2.W28(IO_L4P_T0_D04_14) ; port LA2.LA28_P
LA2_LA29_N: IC2.AC34(IO_L15N_T2_DQS_DOUT_CSO_B_14) ; port LA2.LA29_N
LA2_LA29_P: IC2.AC33(IO_L15P_T2_DQS_RDWR_B_14) ; port LA2.LA29_P
LA2_LA30_N: IC2.W34(IO_L8N_T1_D12_14) ; port LA2.LA30_N
LA2_LA30_P: IC2.W33(IO_L8P_T1_D11_14) ; port LA2.LA30_P
LA2_LA31_N: IC2.V32(IO_L7N_T1_D10_14) ; port LA2.LA31_N
LA2_LA31_P: IC2.V31(IO_L7P_T1_D09_14) ; port LA2.LA31_P
LA2_LA32_N: IC2.AB34(IO_L18N_T2_A11_D27_14) ; port LA2.LA32_N
LA2_LA32_P: IC2.AA34(IO_L18P_T2_A12_D28_14) ; port LA2.LA32_P
LA2_LA33_N: IC2.V34(IO_L9N_T1_DQS_D13_14) ; port LA2.LA33_N
LA2_LA33_P: IC2.V33(IO_L9P_T1_DQS_14) ; port LA2.LA33_P
PLL_VADJ2_DAC1_SYNC_N: IC2.R25(IO_L6P_T0_15) ; port PLL_CTRL.PLL_VADJ2_DAC1_SYNC_N
PLL_VADJ2_DAC2_SYNC_N: IC2.AL24(IO_25_12) ; port PLL_CTRL.PLL_VADJ2_DAC2_SYNC_N
PLL_VADJ2_DAC_DIN: IC2.AF24(IO_25_13) ; port PLL_CTRL.PLL_VADJ2_DAC_DIN
PLL_VADJ2_DAC_SCLK: IC2.AJ24(IO_0_12) ; port PLL_CTRL.PLL_VADJ2_DAC_SCLK
PRI_UART_Rx: IC2.AD26(IO_L15P_T2_DQS_13) TP15.1 ; port PRI_UART_Rx
PRI_UART_Tx: IC2.AE26(IO_L15N_T2_DQS_13) TP14.1 ; port PRI_UART_Tx
PUDC: IC2.W26(IO_L3P_T0_DQS_PUDC_B_14) R180.1
PVADJ2_IO8: IC2.AC28(IO_L19P_T3_A10_D26_14) ; port PVADJ2_IO8
PVADJ2_IO9: IC2.Y26(IO_L3N_T0_DQS_EMCCLK_14) ; port PVADJ2_IO9
PVADJ2_IO10: IC2.T32(IO_L19P_T3_A22_15) ; port PVADJ2_IO10
PVADJ2_IO11: IC2.AE31(IO_L7N_T1_13) ; port PVADJ2_IO11
RTM.P30_IO5_AB_B1_CC_N: R385.1
RTM.P30_IO5_AB_B1_CC_P: R385.2
RTM.P30_IO5_CD_B1_N: R390.5
RTM.P30_IO5_CD_B1_P: R390.6
RTM.P30_IO5_EF_B1_N: R388.5
RTM.P30_IO5_EF_B1_P: R388.6
RTM.P30_IO6_AB_B1_CC_N: R386.5
RTM.P30_IO6_AB_B1_CC_P: R386.6
RTM.P30_IO6_CD_B1_N: R390.3
RTM.P30_IO6_CD_B1_P: R390.4
RTM.P30_IO6_EF_B1_N: R388.3
RTM.P30_IO6_EF_B1_P: R388.4
RTM.P30_IO7_AB_B1_N: R386.3
RTM.P30_IO7_AB_B1_P: R386.4
RTM.P30_IO7_CD_B1_N: R390.1
RTM.P30_IO7_CD_B1_P: R390.2
RTM.P30_IO7_EF_B1_N: R388.1
RTM.P30_IO7_EF_B1_P: R388.2
RTM.P30_IO8_AB_B1_N: R386.1
RTM.P30_IO8_AB_B1_P: R386.2
RTM.P30_IO8_CD_B1_N: R388.7
RTM.P30_IO8_CD_B1_P: R388.8
RTM.P30_IO8_EF_B1_N: R386.7
RTM.P30_IO8_EF_B1_P: R386.8
RTM.P30_IO9_AB_B2_CC_N: R215.3
RTM.P30_IO9_AB_B2_CC_P: R215.4
RTM.P30_IO9_CD_B2_N: R253.3
RTM.P30_IO9_CD_B2_P: R253.4
RTM.P30_IO9_EF_B2_N: R251.7
RTM.P30_IO9_EF_B2_P: R251.8
RTM.P30_IO10_AB_B2_CC_N: R215.1
RTM.P30_IO10_AB_B2_CC_P: R215.2
RTM.P30_IO10_CD_B2_N: R253.1
RTM.P30_IO10_CD_B2_P: R253.2
RTM.P30_IO10_EF_B2_N: R251.5
RTM.P30_IO10_EF_B2_P: R251.6
RTM.P30_OUT0_N: R385.3
RTM.P30_OUT0_P: R385.4
RTM.P30_OUT1_N: R385.5
RTM.P30_OUT1_P: R385.6
RTM.P30_OUT2_N: R385.7
RTM.P30_OUT2_P: R385.8
RTM.P31_IO1_AB_B2_N: R249.7
RTM.P31_IO1_AB_B2_P: R249.8
RTM.P31_IO1_CD_B2_N: R215.7
RTM.P31_IO1_CD_B2_P: R215.8
RTM.P31_IO1_EF_B2_N: R251.3
RTM.P31_IO1_EF_B2_P: R251.4
RTM.P31_IO2_AB_B2_N: R249.5
RTM.P31_IO2_AB_B2_P: R249.6
RTM.P31_IO2_CD_B2_N: R215.5
RTM.P31_IO2_CD_B2_P: R215.6
RTM.P31_IO2_EF_B2_N: R251.1
RTM.P31_IO2_EF_B2_P: R251.2
RTM.P31_IO3_AB_B2_N: R249.3
RTM.P31_IO3_AB_B2_P: R249.4
RTM.P31_IO4_AB_B2_N: R249.1
RTM.P31_IO4_AB_B2_P: R249.2
RTM.P31_IO9_AB_B3_CC_N: R392.1
RTM.P31_IO9_AB_B3_CC_P: R445.1
RTM.P31_IO10_AB_B3_CC_N: R390.7
RTM.P31_IO10_AB_B3_CC_P: R390.8
VADJ2_Helper_TUNE: IC2.U24(IO_25_15) ; port PLL_CTRL.VADJ2_Helper_TUNE
VADJ2_SI57X_OE: IC2.AD23(IO_0_13) ; port PLL_CTRL.VADJ2_SI57X_OE
VADJ2_SI57X_SCL: IC2.V24(IO_0_14) ; port PLL_CTRL.VADJ2_SI57X_SCL
VADJ2_SI57X_SDA: IC2.W24(IO_25_14) ; port PLL_CTRL.VADJ2_SI57X_SDA
VADJ2_SI57X_TUNE: IC2.T24(IO_0_15) ; port PLL_CTRL.VADJ2_SI57X_TUNE

Not connected (* = marked no-connect by the designer): IC2 AE32(IO_L6P_T0_13); R253 5* 6* 7* 8* 9* 10* 11* 12*; R254 5* 6* 7* 8* 9* 10* 11* 12*

## Buses and harness runs
harness RTM = port RTM

## Layout directives
differential pair: CLKS2_CLK0_M2C_N, CLKS2_CLK0_M2C_P, CLKS2_CLK1_M2C_N, CLKS2_CLK1_M2C_P, CLKS2_CLK2_BIDIR_N, CLKS2_CLK2_BIDIR_P, CLKS2_CLK3_BIDIR_N, CLKS2_CLK3_BIDIR_P, HA2_HA00_CC_N, HA2_HA00_CC_P, HA2_HA01_CC_N, HA2_HA01_CC_P, HA2_HA02_N, HA2_HA02_P, HA2_HA03_N, HA2_HA03_P, HA2_HA04_N, HA2_HA04_P, HA2_HA05_N, HA2_HA05_P, HA2_HA06_N, HA2_HA06_P, HA2_HA07_N, HA2_HA07_P, HA2_HA08_N, HA2_HA08_P, HA2_HA09_N, HA2_HA09_P, HA2_HA10_N, HA2_HA10_P, HA2_HA11_N, HA2_HA11_P, HA2_HA12_N, HA2_HA12_P, HA2_HA13_N, HA2_HA13_P, HA14_N, HA14_P, HA15_N, HA15_P, HA16_N, HA16_P, HA17_CC_N, HA17_CC_P, HA18_N, HA18_P, HA19_N, HA19_P, HA20_N, HA20_P, HA21_N, HA21_P, HA22_N, HA22_P, HA23_N, HA23_P, HB2_HB00_CC_N, HB2_HB00_CC_P, HB2_HB01_N, HB2_HB01_P, HB2_HB02_N, HB2_HB02_P, HB2_HB03_N, HB2_HB03_P, HB2_HB04_N, HB2_HB04_P, HB2_HB05_N, HB2_HB05_P, HB2_HB06_CC_N, HB2_HB06_CC_P, HB2_HB07_N, HB2_HB07_P, HB2_HB08_N, HB2_HB08_P, HB2_HB09_N, HB2_HB09_P, HB2_HB10_N, HB2_HB10_P, HB2_HB11_N, HB2_HB11_P, HB2_HB12_N, HB2_HB12_P, HB2_HB13_N, HB2_HB13_P, HB2_HB14_N, HB2_HB14_P, HB2_HB15_N, HB2_HB15_P, HB2_HB17_CC_N, HB2_HB17_CC_P, HB2_HB20_N, HB2_HB20_P, HB2_HB21_N, HB2_HB21_P, HB16_N, HB16_P, HB18_N, HB18_P, HB19_N, HB19_P, LA2_LA00_CC_N, LA2_LA00_CC_P, LA2_LA01_CC_N, LA2_LA01_CC_P, LA2_LA02_N, LA2_LA02_P, LA2_LA03_N, LA2_LA03_P, LA2_LA04_N, LA2_LA04_P, LA2_LA05_N, LA2_LA05_P, LA2_LA06_N, LA2_LA06_P, LA2_LA07_N, LA2_LA07_P, LA2_LA08_N, LA2_LA08_P, LA2_LA09_N, LA2_LA09_P, LA2_LA10_N, LA2_LA10_P, LA2_LA11_N, LA2_LA11_P, LA2_LA12_N, LA2_LA12_P, LA2_LA13_N, LA2_LA13_P, LA2_LA14_N, LA2_LA14_P, LA2_LA15_N, LA2_LA15_P, LA2_LA16_N, LA2_LA16_P, LA2_LA17_CC_N, LA2_LA17_CC_P, LA2_LA18_CC_N, LA2_LA18_CC_P, LA2_LA19_N, LA2_LA19_P, LA2_LA20_N, LA2_LA20_P, LA2_LA21_N, LA2_LA21_P, LA2_LA22_N, LA2_LA22_P, LA2_LA23_N, LA2_LA23_P, LA2_LA24_N, LA2_LA24_P, LA2_LA25_N, LA2_LA25_P, LA2_LA26_N, LA2_LA26_P, LA2_LA27_N, LA2_LA27_P, LA2_LA28_N, LA2_LA28_P, LA2_LA29_N, LA2_LA29_P, LA2_LA30_N, LA2_LA30_P, LA2_LA31_N, LA2_LA31_P, LA2_LA32_N, LA2_LA32_P, LA2_LA33_N, LA2_LA33_P
net class FMC2: CLKS2_CLK0_M2C_N, CLKS2_CLK0_M2C_P, CLKS2_CLK1_M2C_N, CLKS2_CLK1_M2C_P, CLKS2_CLK2_BIDIR_N, CLKS2_CLK2_BIDIR_P, CLKS2_CLK3_BIDIR_N, CLKS2_CLK3_BIDIR_P, FMC2_VREF_A_M2C, FMC2_VREF_B_M2C, HA2_HA00_CC_N, HA2_HA00_CC_P, HA2_HA01_CC_N, HA2_HA01_CC_P, HA2_HA02_N, HA2_HA02_P, HA2_HA03_N, HA2_HA03_P, HA2_HA04_N, HA2_HA04_P, HA2_HA05_N, HA2_HA05_P, HA2_HA06_N, HA2_HA06_P, HA2_HA07_N, HA2_HA07_P, HA2_HA08_N, HA2_HA08_P, HA2_HA09_N, HA2_HA09_P, HA2_HA10_N, HA2_HA10_P, HA2_HA11_N, HA2_HA11_P, HA2_HA12_N, HA2_HA12_P, HA2_HA13_N, HA2_HA13_P, HA2_HA14_N, HA2_HA14_P, HA2_HA15_N, HA2_HA15_P, HA2_HA16_N, HA2_HA16_P, HA2_HA17_CC_N, HA2_HA17_CC_P, HA2_HA18_N, HA2_HA18_P, HA2_HA19_N, HA2_HA19_P, HA2_HA20_N, HA2_HA20_P, HA2_HA21_N, HA2_HA21_P, HA2_HA22_N, HA2_HA22_P, HA2_HA23_N, HA2_HA23_P, LA2_LA00_CC_N, LA2_LA00_CC_P, LA2_LA01_CC_N, LA2_LA01_CC_P, LA2_LA02_N, LA2_LA02_P, LA2_LA03_N, LA2_LA03_P, LA2_LA04_N, LA2_LA04_P, LA2_LA05_N, LA2_LA05_P, LA2_LA06_N, LA2_LA06_P, LA2_LA07_N, LA2_LA07_P, LA2_LA08_N, LA2_LA08_P, LA2_LA09_N, LA2_LA09_P, LA2_LA10_N, LA2_LA10_P, LA2_LA11_N, LA2_LA11_P, LA2_LA12_N, LA2_LA12_P, LA2_LA13_N, LA2_LA13_P, LA2_LA14_N, LA2_LA14_P, LA2_LA15_N, LA2_LA15_P, LA2_LA16_N, LA2_LA16_P, LA2_LA17_CC_N, LA2_LA17_CC_P, LA2_LA18_CC_N, LA2_LA18_CC_P, LA2_LA19_N, LA2_LA19_P, LA2_LA20_N, LA2_LA20_P, LA2_LA21_N, LA2_LA21_P, LA2_LA22_N, LA2_LA22_P, LA2_LA23_N, LA2_LA23_P, LA2_LA24_N, LA2_LA24_P, LA2_LA25_N, LA2_LA25_P, LA2_LA26_N, LA2_LA26_P, LA2_LA27_N, LA2_LA27_P, LA2_LA28_N, LA2_LA28_P, LA2_LA29_N, LA2_LA29_P, LA2_LA30_N, LA2_LA30_P, LA2_LA31_N, LA2_LA31_P, LA2_LA32_N, LA2_LA32_P, LA2_LA33_N, LA2_LA33_P
net class SE60DE100: CLKS2_CLK0_M2C_N, CLKS2_CLK0_M2C_P, CLKS2_CLK1_M2C_N, CLKS2_CLK1_M2C_P, CLKS2_CLK2_BIDIR_N, CLKS2_CLK2_BIDIR_P, CLKS2_CLK3_BIDIR_N, CLKS2_CLK3_BIDIR_P, HA2_HA00_CC_N, HA2_HA00_CC_P, HA2_HA01_CC_N, HA2_HA01_CC_P, HA2_HA02_N, HA2_HA02_P, HA2_HA03_N, HA2_HA03_P, HA2_HA04_N, HA2_HA04_P, HA2_HA05_N, HA2_HA05_P, HA2_HA06_N, HA2_HA06_P, HA2_HA07_N, HA2_HA07_P, HA2_HA08_N, HA2_HA08_P, HA2_HA09_N, HA2_HA09_P, HA2_HA10_N, HA2_HA10_P, HA2_HA11_N, HA2_HA11_P, HA2_HA12_N, HA2_HA12_P, HA2_HA13_N, HA2_HA13_P, HA2_HA14_N, HA2_HA14_P, HA2_HA15_N, HA2_HA15_P, HA2_HA16_N, HA2_HA16_P, HA2_HA17_CC_N, HA2_HA17_CC_P, HA2_HA18_N, HA2_HA18_P, HA2_HA19_N, HA2_HA19_P, HA2_HA20_N, HA2_HA20_P, HA2_HA21_N, HA2_HA21_P, HA2_HA22_N, HA2_HA22_P, HA2_HA23_N, HA2_HA23_P, HB2_HB00_CC_N, HB2_HB00_CC_P, HB2_HB01_N, HB2_HB01_P, HB2_HB02_N, HB2_HB02_P, HB2_HB03_N, HB2_HB03_P, HB2_HB04_N, HB2_HB04_P, HB2_HB05_N, HB2_HB05_P, HB2_HB06_CC_N, HB2_HB06_CC_P, HB2_HB07_N, HB2_HB07_P, HB2_HB08_N, HB2_HB08_P, HB2_HB09_N, HB2_HB09_P, HB2_HB10_N, HB2_HB10_P, HB2_HB11_N, HB2_HB11_P, HB2_HB12_N, HB2_HB12_P, HB2_HB13_N, HB2_HB13_P, HB2_HB14_N, HB2_HB14_P, HB2_HB15_N, HB2_HB15_P, HB2_HB16_N, HB2_HB16_P, HB2_HB17_CC_N, HB2_HB17_CC_P, HB2_HB18_N, HB2_HB18_P, HB2_HB19_N, HB2_HB19_P, HB2_HB20_N, HB2_HB20_P, HB2_HB21_N, HB2_HB21_P, LA2_LA00_CC_N, LA2_LA00_CC_P, LA2_LA01_CC_N, LA2_LA01_CC_P, LA2_LA02_N, LA2_LA02_P, LA2_LA03_N, LA2_LA03_P, LA2_LA04_N, LA2_LA04_P, LA2_LA05_N, LA2_LA05_P, LA2_LA06_N, LA2_LA06_P, LA2_LA07_N, LA2_LA07_P, LA2_LA08_N, LA2_LA08_P, LA2_LA09_N, LA2_LA09_P, LA2_LA10_N, LA2_LA10_P, LA2_LA11_N, LA2_LA11_P, LA2_LA12_N, LA2_LA12_P, LA2_LA13_N, LA2_LA13_P, LA2_LA14_N, LA2_LA14_P, LA2_LA15_N, LA2_LA15_P, LA2_LA16_N, LA2_LA16_P, LA2_LA17_CC_N, LA2_LA17_CC_P, LA2_LA18_CC_N, LA2_LA18_CC_P, LA2_LA19_N, LA2_LA19_P, LA2_LA20_N, LA2_LA20_P, LA2_LA21_N, LA2_LA21_P, LA2_LA22_N, LA2_LA22_P, LA2_LA23_N, LA2_LA23_P, LA2_LA24_N, LA2_LA24_P, LA2_LA25_N, LA2_LA25_P, LA2_LA26_N, LA2_LA26_P, LA2_LA27_N, LA2_LA27_P, LA2_LA28_N, LA2_LA28_P, LA2_LA29_N, LA2_LA29_P, LA2_LA30_N, LA2_LA30_P, LA2_LA31_N, LA2_LA31_P, LA2_LA32_N, LA2_LA32_P, LA2_LA33_N, LA2_LA33_P
net class DE_SIG: CLKS2_CLK0_M2C_N, CLKS2_CLK0_M2C_P, CLKS2_CLK1_M2C_N, CLKS2_CLK1_M2C_P, CLKS2_CLK2_BIDIR_N, CLKS2_CLK2_BIDIR_P, CLKS2_CLK3_BIDIR_N, CLKS2_CLK3_BIDIR_P, HA2_HA00_CC_N, HA2_HA00_CC_P, HA2_HA01_CC_N, HA2_HA01_CC_P, HA2_HA02_N, HA2_HA02_P, HA2_HA03_N, HA2_HA03_P, HA2_HA04_N, HA2_HA04_P, HA2_HA05_N, HA2_HA05_P, HA2_HA06_N, HA2_HA06_P, HA2_HA07_N, HA2_HA07_P, HA2_HA08_N, HA2_HA08_P, HA2_HA09_N, HA2_HA09_P, HA2_HA10_N, HA2_HA10_P, HA2_HA11_N, HA2_HA11_P, HA2_HA12_N, HA2_HA12_P, HA2_HA13_N, HA2_HA13_P, HA2_HA14_N, HA2_HA14_P, HA2_HA15_N, HA2_HA15_P, HA2_HA16_N, HA2_HA16_P, HA2_HA17_CC_N, HA2_HA17_CC_P, HA2_HA18_N, HA2_HA18_P, HA2_HA19_N, HA2_HA19_P, HA2_HA20_N, HA2_HA20_P, HA2_HA21_N, HA2_HA21_P, HA2_HA22_N, HA2_HA22_P, HA2_HA23_N, HA2_HA23_P, HB2_HB00_CC_N, HB2_HB00_CC_P, HB2_HB01_N, HB2_HB01_P, HB2_HB02_N, HB2_HB02_P, HB2_HB03_N, HB2_HB03_P, HB2_HB04_N, HB2_HB04_P, HB2_HB05_N, HB2_HB05_P, HB2_HB06_CC_N, HB2_HB06_CC_P, HB2_HB07_N, HB2_HB07_P, HB2_HB08_N, HB2_HB08_P, HB2_HB09_N, HB2_HB09_P, HB2_HB10_N, HB2_HB10_P, HB2_HB11_N, HB2_HB11_P, HB2_HB12_N, HB2_HB12_P, HB2_HB13_N, HB2_HB13_P, HB2_HB14_N, HB2_HB14_P, HB2_HB15_N, HB2_HB15_P, HB2_HB16_N, HB2_HB16_P, HB2_HB17_CC_N, HB2_HB17_CC_P, HB2_HB18_N, HB2_HB18_P, HB2_HB19_N, HB2_HB19_P, HB2_HB20_N, HB2_HB20_P, HB2_HB21_N, HB2_HB21_P, LA2_LA00_CC_N, LA2_LA00_CC_P, LA2_LA01_CC_N, LA2_LA01_CC_P, LA2_LA02_N, LA2_LA02_P, LA2_LA03_N, LA2_LA03_P, LA2_LA04_N, LA2_LA04_P, LA2_LA05_N, LA2_LA05_P, LA2_LA06_N, LA2_LA06_P, LA2_LA07_N, LA2_LA07_P, LA2_LA08_N, LA2_LA08_P, LA2_LA09_N, LA2_LA09_P, LA2_LA10_N, LA2_LA10_P, LA2_LA11_N, LA2_LA11_P, LA2_LA12_N, LA2_LA12_P, LA2_LA13_N, LA2_LA13_P, LA2_LA14_N, LA2_LA14_P, LA2_LA15_N, LA2_LA15_P, LA2_LA16_N, LA2_LA16_P, LA2_LA17_CC_N, LA2_LA17_CC_P, LA2_LA18_CC_N, LA2_LA18_CC_P, LA2_LA19_N, LA2_LA19_P, LA2_LA20_N, LA2_LA20_P, LA2_LA21_N, LA2_LA21_P, LA2_LA22_N, LA2_LA22_P, LA2_LA23_N, LA2_LA23_P, LA2_LA24_N, LA2_LA24_P, LA2_LA25_N, LA2_LA25_P, LA2_LA26_N, LA2_LA26_P, LA2_LA27_N, LA2_LA27_P, LA2_LA28_N, LA2_LA28_P, LA2_LA29_N, LA2_LA29_P, LA2_LA30_N, LA2_LA30_P, LA2_LA31_N, LA2_LA31_P, LA2_LA32_N, LA2_LA32_P, LA2_LA33_N, LA2_LA33_P
net class FMC2_HA: HA2_HA00_CC_N, HA2_HA00_CC_P, HA2_HA01_CC_N, HA2_HA01_CC_P, HA2_HA02_N, HA2_HA02_P, HA2_HA03_N, HA2_HA03_P, HA2_HA04_N, HA2_HA04_P, HA2_HA05_N, HA2_HA05_P, HA2_HA06_N, HA2_HA06_P, HA2_HA07_N, HA2_HA07_P, HA2_HA08_N, HA2_HA08_P, HA2_HA09_N, HA2_HA09_P, HA2_HA10_N, HA2_HA10_P, HA2_HA11_N, HA2_HA11_P, HA2_HA12_N, HA2_HA12_P, HA2_HA13_N, HA2_HA13_P, HA2_HA14_N, HA2_HA14_P, HA2_HA15_N, HA2_HA15_P, HA2_HA16_N, HA2_HA16_P, HA2_HA17_CC_N, HA2_HA17_CC_P, HA2_HA18_N, HA2_HA18_P, HA2_HA19_N, HA2_HA19_P, HA2_HA20_N, HA2_HA20_P, HA2_HA21_N, HA2_HA21_P, HA2_HA22_N, HA2_HA22_P, HA2_HA23_N, HA2_HA23_P
net class POWER: FMC2_VREF_A_M2C, FMC2_VREF_B_M2C
net class FMC2_REST: CLKS2_CLK0_M2C_N, CLKS2_CLK0_M2C_P, CLKS2_CLK1_M2C_N, CLKS2_CLK1_M2C_P, CLKS2_CLK2_BIDIR_N, CLKS2_CLK2_BIDIR_P, CLKS2_CLK3_BIDIR_N, CLKS2_CLK3_BIDIR_P, FMC2_VREF_A_M2C, FMC2_VREF_B_M2C
net class FMC2_HB: HB2_HB00_CC_N, HB2_HB00_CC_P, HB2_HB01_N, HB2_HB01_P, HB2_HB02_N, HB2_HB02_P, HB2_HB03_N, HB2_HB03_P, HB2_HB04_N, HB2_HB04_P, HB2_HB05_N, HB2_HB05_P, HB2_HB06_CC_N, HB2_HB06_CC_P, HB2_HB07_N, HB2_HB07_P, HB2_HB08_N, HB2_HB08_P, HB2_HB09_N, HB2_HB09_P, HB2_HB10_N, HB2_HB10_P, HB2_HB11_N, HB2_HB11_P, HB2_HB12_N, HB2_HB12_P, HB2_HB13_N, HB2_HB13_P, HB2_HB14_N, HB2_HB14_P, HB2_HB15_N, HB2_HB15_P, HB2_HB16_N, HB2_HB16_P, HB2_HB17_CC_N, HB2_HB17_CC_P, HB2_HB18_N, HB2_HB18_P, HB2_HB19_N, HB2_HB19_P, HB2_HB20_N, HB2_HB20_P, HB2_HB21_N, HB2_HB21_P
net class FMC2_LA: LA2_LA00_CC_N, LA2_LA00_CC_P, LA2_LA01_CC_N, LA2_LA01_CC_P, LA2_LA02_N, LA2_LA02_P, LA2_LA03_N, LA2_LA03_P, LA2_LA04_N, LA2_LA04_P, LA2_LA05_N, LA2_LA05_P, LA2_LA06_N, LA2_LA06_P, LA2_LA07_N, LA2_LA07_P, LA2_LA08_N, LA2_LA08_P, LA2_LA09_N, LA2_LA09_P, LA2_LA10_N, LA2_LA10_P, LA2_LA11_N, LA2_LA11_P, LA2_LA12_N, LA2_LA12_P, LA2_LA13_N, LA2_LA13_P, LA2_LA14_N, LA2_LA14_P, LA2_LA15_N, LA2_LA15_P, LA2_LA16_N, LA2_LA16_P, LA2_LA17_CC_N, LA2_LA17_CC_P, LA2_LA18_CC_N, LA2_LA18_CC_P, LA2_LA19_N, LA2_LA19_P, LA2_LA20_N, LA2_LA20_P, LA2_LA21_N, LA2_LA21_P, LA2_LA22_N, LA2_LA22_P, LA2_LA23_N, LA2_LA23_P, LA2_LA24_N, LA2_LA24_P, LA2_LA25_N, LA2_LA25_P, LA2_LA26_N, LA2_LA26_P, LA2_LA27_N, LA2_LA27_P, LA2_LA28_N, LA2_LA28_P, LA2_LA29_N, LA2_LA29_P, LA2_LA30_N, LA2_LA30_P, LA2_LA31_N, LA2_LA31_P, LA2_LA32_N, LA2_LA32_P, LA2_LA33_N, LA2_LA33_P
net class BANK_12: HA00_CC_N, HA00_CC_P, HA01_CC_N, HA01_CC_P, HA02_N, HA02_P, HA03_N, HA03_P, HA04_N, HA04_P, HA05_N, HA05_P, HA06_N, HA06_P, HA07_N, HA07_P, HA08_N, HA08_P, HA09_N, HA09_P, HA10_N, HA10_P, HA11_N, HA11_P, HA12_N, HA12_P, HA13_N, HA13_P, HA14_N, HA14_P, HA15_N, HA15_P, HA16_N, HA16_P, HA17_CC_N, HA17_CC_P, HA18_N, HA18_P, HA19_N, HA19_P, HA20_N, HA20_P, HA21_N, HA21_P, HA22_N, HA22_P, HA23_N, HA23_P, PLL_VADJ2_DAC2_SYNC_N, PLL_VADJ2_DAC_SCLK
net class BANK_13: CLKS2_CLK1_M2C_N, CLKS2_CLK1_M2C_P, CLKS2_CLK2_BIDIR_N, CLKS2_CLK2_BIDIR_P, FMC2_VREF_A_M2C, FPGA_RESET_Dn, LA2_LA00_CC_N, LA2_LA00_CC_P, LA2_LA01_CC_N, LA2_LA01_CC_P, LA2_LA02_N, LA2_LA02_P, LA2_LA03_N, LA2_LA03_P, LA2_LA04_N, LA2_LA04_P, LA2_LA05_N, LA2_LA05_P, LA2_LA06_N, LA2_LA06_P, LA2_LA07_N, LA2_LA07_P, LA2_LA08_N, LA2_LA08_P, LA2_LA09_N, LA2_LA09_P, LA2_LA10_N, LA2_LA10_P, LA2_LA11_N, LA2_LA11_P, LA2_LA12_N, LA2_LA12_P, LA2_LA13_N, LA2_LA13_P, LA2_LA14_N, LA2_LA14_P, LA2_LA15_N, LA2_LA15_P, LA2_LA16_N, LA2_LA16_P, PLL_VADJ2_DAC_DIN, VADJ2_SI57X_OE
net class BANK_14: CLKS2_CLK0_M2C_N, CLKS2_CLK0_M2C_P, CLKS2_CLK3_BIDIR_N, CLKS2_CLK3_BIDIR_P, FLASH_D2, FLASH_D3, FLASH_FCS_~{B}, FLASH_Q/D1, FLASH_SI/D0, FMC2_VREF_A_M2C, LA2_LA17_CC_N, LA2_LA17_CC_P, LA2_LA18_CC_N, LA2_LA18_CC_P, LA2_LA19_N, LA2_LA19_P, LA2_LA20_N, LA2_LA20_P, LA2_LA21_N, LA2_LA21_P, LA2_LA22_N, LA2_LA22_P, LA2_LA23_N, LA2_LA23_P, LA2_LA24_N, LA2_LA24_P, LA2_LA25_N, LA2_LA25_P, LA2_LA26_N, LA2_LA26_P, LA2_LA27_N, LA2_LA27_P, LA2_LA28_N, LA2_LA28_P, LA2_LA29_N, LA2_LA29_P, LA2_LA30_N, LA2_LA30_P, LA2_LA31_N, LA2_LA31_P, LA2_LA32_N, LA2_LA32_P, LA2_LA33_N, LA2_LA33_P, PUDC, VADJ2_SI57X_SCL, VADJ2_SI57X_SDA
net class BANK_15: FMC2_VREF_B_M2C, HB00_CC_N, HB00_CC_P, HB01_N, HB01_P, HB02_N, HB02_P, HB03_N, HB03_P, HB04_N, HB04_P, HB05_N, HB05_P, HB06_CC_N, HB06_CC_P, HB07_N, HB07_P, HB08_N, HB08_P, HB09_N, HB09_P, HB10_N, HB10_P, HB11_N, HB11_P, HB12_N, HB12_P, HB13_N, HB13_P, HB14_N, HB14_P, HB15_N, HB15_P, HB16_N, HB16_P, HB17_CC_N, HB17_CC_P, HB18_N, HB18_P, HB19_N, HB19_P, HB20_N, HB20_P, HB21_N, HB21_P, PLL_VADJ2_DAC1_SYNC_N, VADJ2_Helper_TUNE, VADJ2_SI57X_TUNE
net class FMC2_CLKS: CLKS2_CLK0_M2C_N, CLKS2_CLK0_M2C_P, CLKS2_CLK1_M2C_N, CLKS2_CLK1_M2C_P, CLKS2_CLK2_BIDIR_N, CLKS2_CLK2_BIDIR_P, CLKS2_CLK3_BIDIR_N, CLKS2_CLK3_BIDIR_P
net class FMC2_HA_CC: HA2_HA00_CC_N, HA2_HA00_CC_P, HA2_HA01_CC_N, HA2_HA01_CC_P, HA2_HA16_P, HA2_HA17_CC_N, HA2_HA17_CC_P
net class FMC2_HB_CC: HB2_HB00_CC_N, HB2_HB00_CC_P, HB2_HB06_CC_N, HB2_HB06_CC_P, HB2_HB16_P, HB2_HB17_CC_N, HB2_HB17_CC_P
net class FMC2_LA_CC: LA2_LA00_CC_N, LA2_LA00_CC_P, LA2_LA01_CC_N, LA2_LA01_CC_P, LA2_LA17_CC_N, LA2_LA17_CC_P, LA2_LA18_CC_N, LA2_LA18_CC_P

## Notes on the sheet
- Project/Equipment
- Document
- Designer
- Drawn by
- Check.by
- Last Mod.
- Copyright WUT ISE 2020
  This documentation describes Open Hardware and is licensed under CERN OHL v.1.1. You may redistribute and modify this documentaction under the terms of the CERN OHL v1.1.
  (http://ohwr.org/CERNOHL). This documentation is dristributed WITHOUT ANY EXPRESS OR IMPLIED WARRANTY, INCLUDING OF MERCHANTABLITY, SATISFACTORY QUALITY AND FITNESS FOR A PARTICULAR PURPOSE. Please see the CERN OHL v.1.1 for applicable conditions
- Contact:
- File
- Print Date
- Sheet
- Size
- A2
- of
- Rev
- (in symbol R0402_10K_1%_0.0625W_100PPM) 1%
- (in symbol XC7A200T-3FFG1156C, part A) BANK 12
- (in symbol XC7A200T-3FFG1156C, part B) BANK 13
- (in symbol XC7A200T-3FFG1156C, part C) BANK 14
- (in symbol XC7A200T-3FFG1156C, part D) BANK 15

## Library data of the parts
C124 C125 C129 C131 C132 C392 = CC0201_100NF_6.3V_10%_X5R: Non-polarised capacitor; Part Description: SMD Multilayer Chip Ceramic Capacitor; Manufacturer: GENERIC; Manufacturer1 Part Number: 02016D104KAT2A; Voltage: 6.3V; TC: X5R; Tolerance: ±10%; Table: Capacitors SMD; Part Number: CC0201_100NF_6.3V_10%_X5R; Component Kind: Standard; Component Type: Standard; Pin Count: 2; Value: 100nF; Status: Not Recommended; Manufacturer Part Number: CC0201_100NF_6.3V_10%_X5R; Case: 0201; Mounted: Yes; Socket: No; SMD: Yes; Manufacturer1 Example: AVX; Manufacturer1 ComponentHeight: 0.33mm; HelpURL: \\cern.ch\dfs\Applications\Altium\Datasheets\CC0201_X5R_AVX.pdf; Author: CERN DEM JLC; CreateDate: 2007-12-03; LatestRevisionDate: 2007-12-03
D3 = BAT165: Schottky Diode; Part Description: Medium Power AF Schottky Diode; Manufacturer: INFINEON; Voltage: 40V; Power: 750mA; PressFit: No; Bonding: No; Part Number: BAT165; Component Kind: Standard; Component Type: Standard; Device: BAT165; PackageDescription: Small Outline Diode (SOD-323), 1.70mm W X 1.25mm L X 1.10mm H body,  IPC Medium Density; Manufacturer Part Number: BAT165; Pin Count: 2; Case: SOD323; Mounted: Yes; Socket: No; SMD: Yes; Sense: No; ComponentHeight: 1.1mm; HelpURL: \\cern.ch\dfs\Applications\Altium\Datasheets\BAT165.pdf; Author: CERN DEM JLC; CreateDate: 12.11.2014; LatestRevisionDate: 12.11.2014
IC2 = XC7A200T-3FFG1156C: Artix-6 FPGA, 16 GTPs, 600 User I/Os, 1156-Pin BGA, Speed Grade 2, Commercial Grade, Pb-Free; Part Description: Artix-7 FPGA, 16 GTPs, 600 User I/Os, 1156-Pin BGA, Speed Grade 2, Commercial Grade, Pb-Free; Manufacturer: XILINX; Table: Logic; Part Number: XC7A200T-3FFG1156C; Component Kind: Standard; Component Type: Standard; Device: XC7A200T-3FFG1156C; PackageDescription: BGA, 1.00mm Pitch, Square; 1156 Pin, 34 Columns X 34 Rows, 35.00mm X 35.00mm X 3.350mm H; Manufacturer Part Number: XC7A200T-3FFG1156C; Pin Count: 1156; Case: BGA1156; Mounted: Yes; Socket: No; SMD: Yes; ComponentHeight: 3.35mm; HelpURL: \\cern.ch\dfs\Applications\Altium\Datasheets\XC7A350T-2FFG1156C.pdf; ComponentLink1URL: \\cern.ch\dfs\Applications\Altium\Datasheets\XC7A350T-2FFG1156C.pdf; ComponentLink1Description: Package/Pinout; Author: CERN DEM JLC; CreateDate: 2012-09-19; LatestRevisionDate: 2012-09-19
R180 R270 = R0402_10K_1%_0.0625W_100PPM: Resistor - 1%; Part Description: General Purpose Thick Film Chip Resistor; Manufacturer: GENERIC; Manufacturer1 Part Number: 232270671003L; TC: ±100ppm/°C; Table: Resistors SMD; Part Number: R0402_10K_1%_0.0625W_100PPM; Component Kind: Standard; Component Type: Standard; Pin Count: 2; Value: 10k; Status: Not recommended; Power: 0.0625W; Tolerance: ±1%; Manufacturer Part Number: R0402_10K_1%_0.0625W_100PPM; Case: 0402; Mounted: Yes; Socket: No; SMD: Yes; Manufacturer1 Example: YAGEO PHYCOMP; Manufacturer1 ComponentHeight: 0.4mm; HelpURL: \\cern.ch\dfs\Applications\Altium\Datasheets\R0402_Phycomp_RC0402.pdf; Author: CERN DEM JLC; CreateDate: 2007-12-03; LatestRevisionDate: 2012-10-17
R215 R243 R245 R249-R254 R385-R391 = Resistor: Value: 0
R392 R393 R445 R446 = R0201_0R_JUMPER: Resistor; Part Description: 1A (0.05R Max DC Resistance) Zero Ohm Jumper; Manufacturer: GENERIC; Manufacturer1 Part Number: CRCW02010000Z0ED; PressFit: No; Part Number: R0201_0R_JUMPER; Component Kind: Standard; Component Type: Standard; Pin Count: 2; Value: 0; Status: Not Recommended; Manufacturer Part Number: R0201_0R_JUMPER; Case: 0201; Mounted: Yes; Sense: No; Socket: No; SMD: Yes; Manufacturer1 Example: VISHAY; Manufacturer1 ComponentHeight: 0.27mm; HelpURL: \\cern.ch\dfs\Applications\Altium\Datasheets\R0201_VISHAY_CRCW e3.pdf; Author: CERN DEM JLC; CreateDate: 19.11.2014; LatestRevisionDate: 08.01.2015
TP4 TP13-TP15 = TP: Testpoint